# EAGLE design untitled (EAGLE 7.6.0)
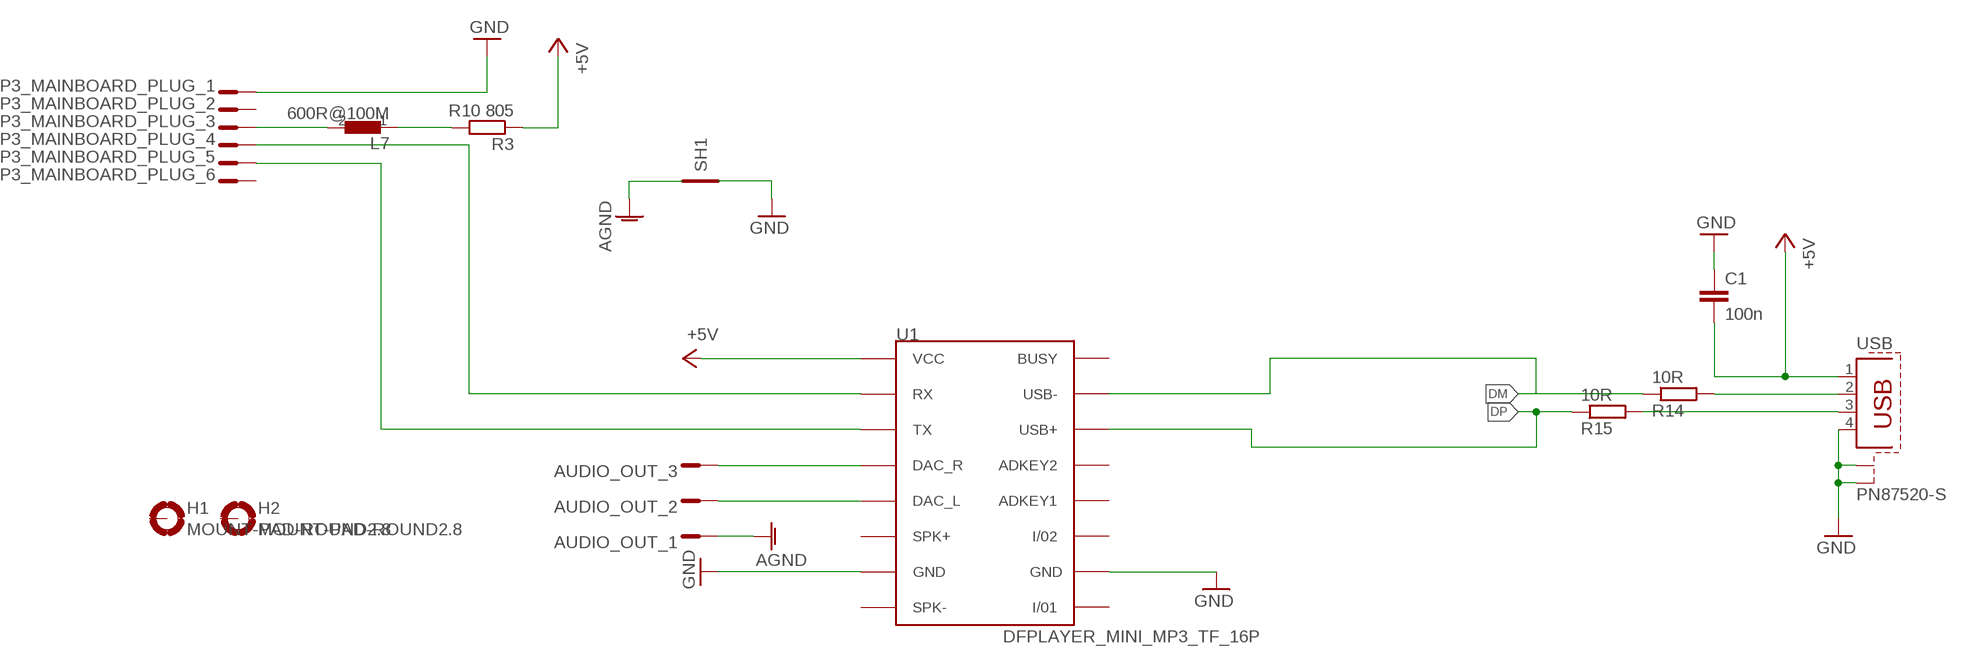
[diagram p0: schematic, sheet 1]

## Parts
AUDIO_OUT  JST_3_PIN_B3B-PH-KS  [B3B-PH-KS]
C1  100n  C-EUC0805  [C0805]
H1  MOUNT-PAD-ROUND2.8  [2,8-PAD]
H2  MOUNT-PAD-ROUND2.8  [2,8-PAD]
L7  600R@100M  FERRITR0805  [R0805]
MP3_MAINBOARD_PLUG  JST_6_PIN_B6B-PH-KS  [B6B-PH-KS]
R3  R10 805  R-EU_R0805  [R0805]
R14  10R  R-EU_R0805  [R0805]
R15  10R  R-EU_R0805  [R0805]
SH1  SHORT-V12_MILS  [12_MILS]
U1  DFPLAYER_MINI_MP3_TF_16P  [20_5M_SQUARE]
USB  PN87520-S  [PN87520-S]

## Nets
+5V: C1.2 R3.1 U1.P$1(VCC) USB.1
AGND: AUDIO_OUT.P$1 SH1.P$2
DM: R14.1 U1.P$15(USB-)
DP: R15.1 U1.P$14(USB+)
GND: C1.1 MP3_MAINBOARD_PLUG.P$1 SH1.P$1 U1.P$7(GND) U1.P$10(GND1) USB.4 USB.S1 USB.S2
N$1: AUDIO_OUT.P$3 U1.P$4(DAC_R)
N$2: AUDIO_OUT.P$2 U1.P$5(DAC_L)
N$3: L7.2 MP3_MAINBOARD_PLUG.P$3
N$4: MP3_MAINBOARD_PLUG.P$4 U1.P$2(RX)
N$5: MP3_MAINBOARD_PLUG.P$5 U1.P$3(TX)
N$9: R15.2 USB.3
N$10: R14.2 USB.2
N$16: L7.1 R3.2
Unconnected: H1.B2,8(MOUNT) H2.B2,8(MOUNT) MP3_MAINBOARD_PLUG.P$2 MP3_MAINBOARD_PLUG.P$6 U1.P$6(SPK+) U1.P$8(SPK-) U1.P$9(I/01) U1.P$11(I/02) U1.P$12(ADKEY1) U1.P$13(ADKEY2) U1.P$16(BUSY)

## Library data of the parts
AUDIO_OUT = conn-JST:JST_3_PIN_
C1 = rcl:C-EU: CAPACITOR, European symbol
H1 H2 = holes:MOUNT-PAD-ROUND: MOUNTING PAD, round
L7 = ferrit_bear:FERRIT
MP3_MAINBOARD_PLUG = conn-JST:JST_6_PIN_
R3 R14 R15 = rcl:R-EU_: RESISTOR, European symbol
SH1 = shorts-old:SHORT-V: Short between two nets
U1 = DFPlayer_mini:DFPLAYER_MINI_MP3_TF_16P
USB = con-berg:PN87520-S; OC_FARNELL: unknown; OC_NEWARK: unknown

## Board
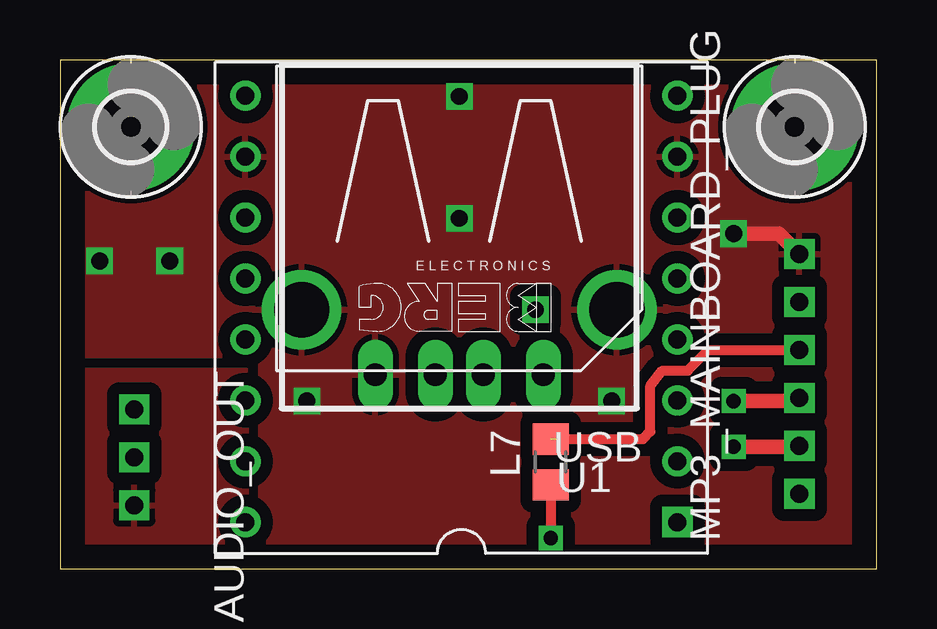
[diagram p1: board, top side]
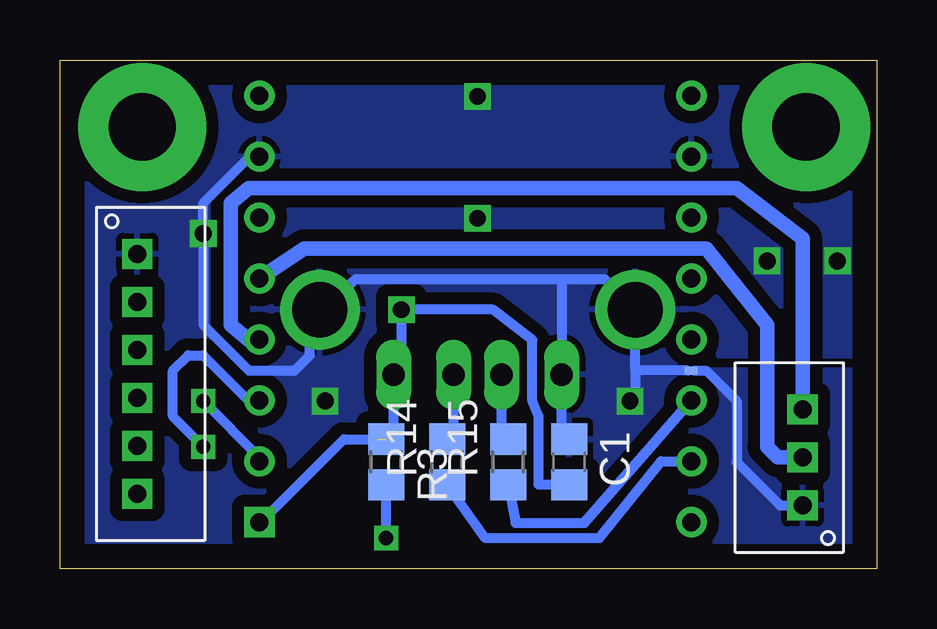
[diagram p2: board, bottom side, seen from below]

Size 34.04 x 21.21 mm. Coordinates in mm from the lower left corner, seen from the top.
Outline: 0,0 34.04,0 34.04,21.21 0,21.21 0,0
Copper layers (1*16): Top 0.035mm / dielectric 1.5mm / Bottom 0.035mm
Design rules "default": minimum track width 10mil, minimum drill 24mil, track to track 8mil, track to pad 8mil, pad to pad 8mil, via to via 8mil, smd to smd 8mil, copper to edge 40mil, drill to drill 8mil, minimum pad ring 10mil, minimum via ring 8mil, stop-mask expansion 4mil, vias tented up to drill 0mil, thermal gap 10mil

### Footprints (pad centres in the part's own frame; a part is rotated, then mirrored left to right if it is on the bottom)
B3B-PH-KS = drill 0.75 pad 1.2 square: P$1 -2,1.7; P$2 -4,1.7; P$3 -6,1.7
C0805 = smd 1.3 x 1.5: 1 -0.95,0; 2 0.95,0
2,8-PAD = drill 2.8 pad 5.334: B2,8 0,0
R0805 = smd 1.3 x 1.5: 1 -0.95,0; 2 0.95,0
B6B-PH-KS = drill 0.75 pad 1.2 square: P$1 -2,1.7; P$2 -4,1.7; P$3 -6,1.7; P$4 -8,1.7; P$5 -10,1.7; P$6 -12,1.7
12_MILS = smd 0.254 x 0.305: P$1 -0.127,0; P$2 0.127,0
20_5M_SQUARE = drill 0.75 square: P$1 -9.09,7.59 | drill 0.75: P$2 -9.09,5.05; P$3 -9.09,2.51; P$4 -9.09,-0.03; P$5 -9.09,-2.57; P$6 -9.09,-5.11; P$7 -9.09,-7.65; P$8 -9.09,-10.19; P$9 8.91,-10.19; P$10 8.91,-7.65; P$11 8.91,-5.11; P$12 8.91,-2.57; P$13 8.91,-0.03; P$14 8.91,2.51; P$15 8.91,5.05; P$16 8.91,7.59
PN87520-S = drill 0.95 long: 1 -3.5,2.71; 2 -1,2.71; 3 1,2.71; 4 3.5,2.71 | drill 2.3 pad 2.9: S1 -6.57,0; S2 6.57,0

### Placement (x,y rotation side)
AUDIO_OUT  1.4,0.63 270 top
C1  12.83,4.45 270 bottom
H1  2.95,18.41 0 top
H2  30.61,18.41 0 top
L7  20.45,4.45 90 top
MP3_MAINBOARD_PLUG  32.51,15.11 90 top
R3  20.45,4.45 270 bottom
R14  17.91,4.45 90 bottom
R15  15.37,4.45 90 bottom
SH1  7.75,8.25 0 bottom
U1  16.64,9.52 180 top
USB  16.64,10.8 180 top

### Tracks (layer width: path | path; a pad name or v marks a point on that pad's centre or on a via)
+5V  (via drill 0.7)  (1 unrouted)
  Bottom 0.406: 20.77,5.39 20.14,6.02 USB.1 19.81,8.41 v19.81,10.8 16,10.8 14.35,9.52 14.35,6.98 14.1,6.35 14.1,3.49 C1.2 | R3.1 22.21,5.39 25.7,1.9 U1.P$1
AGND
  Bottom 0.406: SH1.P$2 7.11,8.25 5.84,6.98 5.84,4.45 4.03,2.63 AUDIO_OUT.P$1
  pour Top (isolate 0.508): -1.14,8.25 7.75,8.25 7.75,-2.54 -1.14,-2.54
  pour Bottom (isolate 0.508): -0.51,8.25 7.75,8.25 7.75,-1.91 -0.51,-1.91
DM
  Bottom 0.406: R14.1 16.32,1.27 11.56,1.27 8.99,4.47 U1.P$15
DP
  Bottom 0.406: R15.1 15.05,1.9 12.19,1.9 U1.P$14
GND  (via drill 0.7)
  Top 0.61: MP3_MAINBOARD_PLUG.P$1 29.95,13.97 v28.07,13.97
  Bottom 0.406: 13.14,12.06 USB.4 13.14,5.39 C1.1 | 13.14,12.06 21.72,12.06 USB.S1 23.62,10.38 23.62,8.89 24.26,8.25 26.16,8.25 28.07,10.16 v28.07,13.97 28.07,15.24 26.16,17.14 26.16,17.17 U1.P$7 | 13.14,12.06 11.34,12.06 USB.S2 10.07,8.25 | SH1.P$1 10.07,8.25 | 10.07,8.25 10.07,6.98 v10.29,6.98
  other vias: 16.64,14.6 22.99,6.98 4.57,12.83 16.64,19.68 1.65,12.83
  pour Bottom (isolate 0.508): -0.51,22.23 36.32,22.23 36.32,-1.91 8.38,-1.91 8.38,8.89 -0.51,8.89
  pour Top (isolate 0.508): -1.14,22.86 36.96,22.86 36.96,-2.54 8.38,-2.54 8.38,8.89 -1.14,8.89
N$1
  Bottom 0.61: U1.P$4 25.76,9.52 26.16,9.52 26.92,10.16 26.92,15.24 26.16,15.88 5.84,15.88 3.1,13.77 AUDIO_OUT.P$3
N$2
  Bottom 0.61: U1.P$5 23.85,13.34 7.11,13.34 4.57,10.16 4.57,5.08 4.13,4.63 AUDIO_OUT.P$2
N$3
  Top 0.406: MP3_MAINBOARD_PLUG.P$3 27.02,9.11 26.16,8.25 25.1,8.25 24.6,7.62 24.6,5.71 24.28,5.39 L7.2
N$4  (via drill 0.6)
  Top 0.61: MP3_MAINBOARD_PLUG.P$4 30.68,6.98 v28.07,6.98
  Bottom 0.406: v28.07,6.98 25.73,4.64 U1.P$2
N$5  (via drill 0.6)
  Top 0.61: MP3_MAINBOARD_PLUG.P$5 30.78,5.08 v28.07,5.08
  Bottom 0.406: v28.07,5.08 29.34,6.35 29.34,8.25 28.7,8.89 28.07,8.89 26.19,7.01 U1.P$3
N$9
  Bottom 0.406: R15.2 15.64,5.66 USB.3
N$10
  Bottom 0.406: R14.2 17.64,5.66 USB.2
N$16  (via drill 0.6)
  Top 0.406: L7.1 v20.45,1.27
  Bottom 0.406: v20.45,1.27 L7.1